# EAGLE schematic DiodeOR (EAGLE 9.1.2)
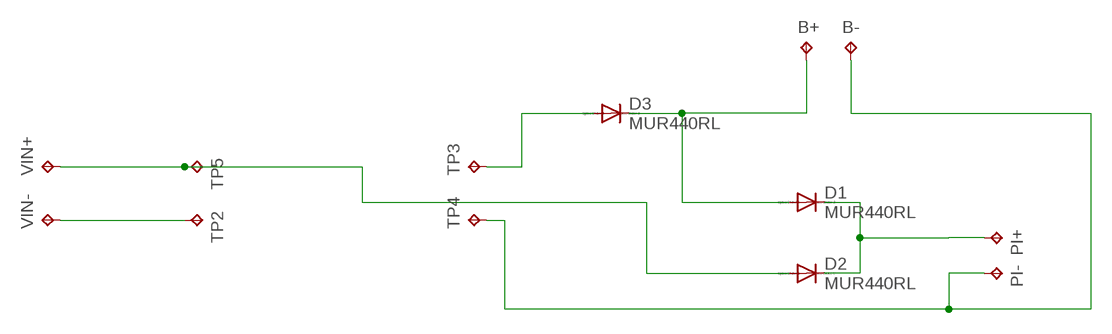
[diagram p0: schematic, sheet 1]

## Parts
B+  TPPAD1-20Y  [P1-20Y]
B-  TPPAD1-20Y  [P1-20Y]
D1  MUR440RL  [C2673]
D2  MUR440RL  [C2673]
D3  MUR440RL  [C2673]
PI+  TPPAD1-20Y  [P1-20Y]
PI-  TPPAD1-20Y  [P1-20Y]
TP2  TPPAD1-20Y  [P1-20Y]
TP3  TPPAD1-20Y  [P1-20Y]
TP4  TPPAD1-20Y  [P1-20Y]
TP5  TPPAD1-20Y  [P1-20Y]
VIN+  TPPAD1-20Y  [P1-20Y]
VIN-  TPPAD1-20Y  [P1-20Y]

## Nets
N$1: D1.C D2.C PI+.TP
N$2: B+.TP D1.A D3.C
N$3: D3.A TP3.TP
N$4: B-.TP PI-.TP TP4.TP
N$5: TP2.TP VIN-.TP
N$6: D2.A TP5.TP VIN+.TP

## Library data of the parts
B+ B- PI+ PI- TP2-TP5 VIN+ VIN- = testpad:TP: Test pad
D1-D3 = diode:MUR440RL: DIODE ultra-fast recovery rectifier, Vrrm = 40 V, 4 A

## Net classes
0 default: width 1.27 mm, drill 1.27 mm, clearance 1.016 mm